# EAGLE schematic PCB-VU-SE-1 (EAGLE 6.4)
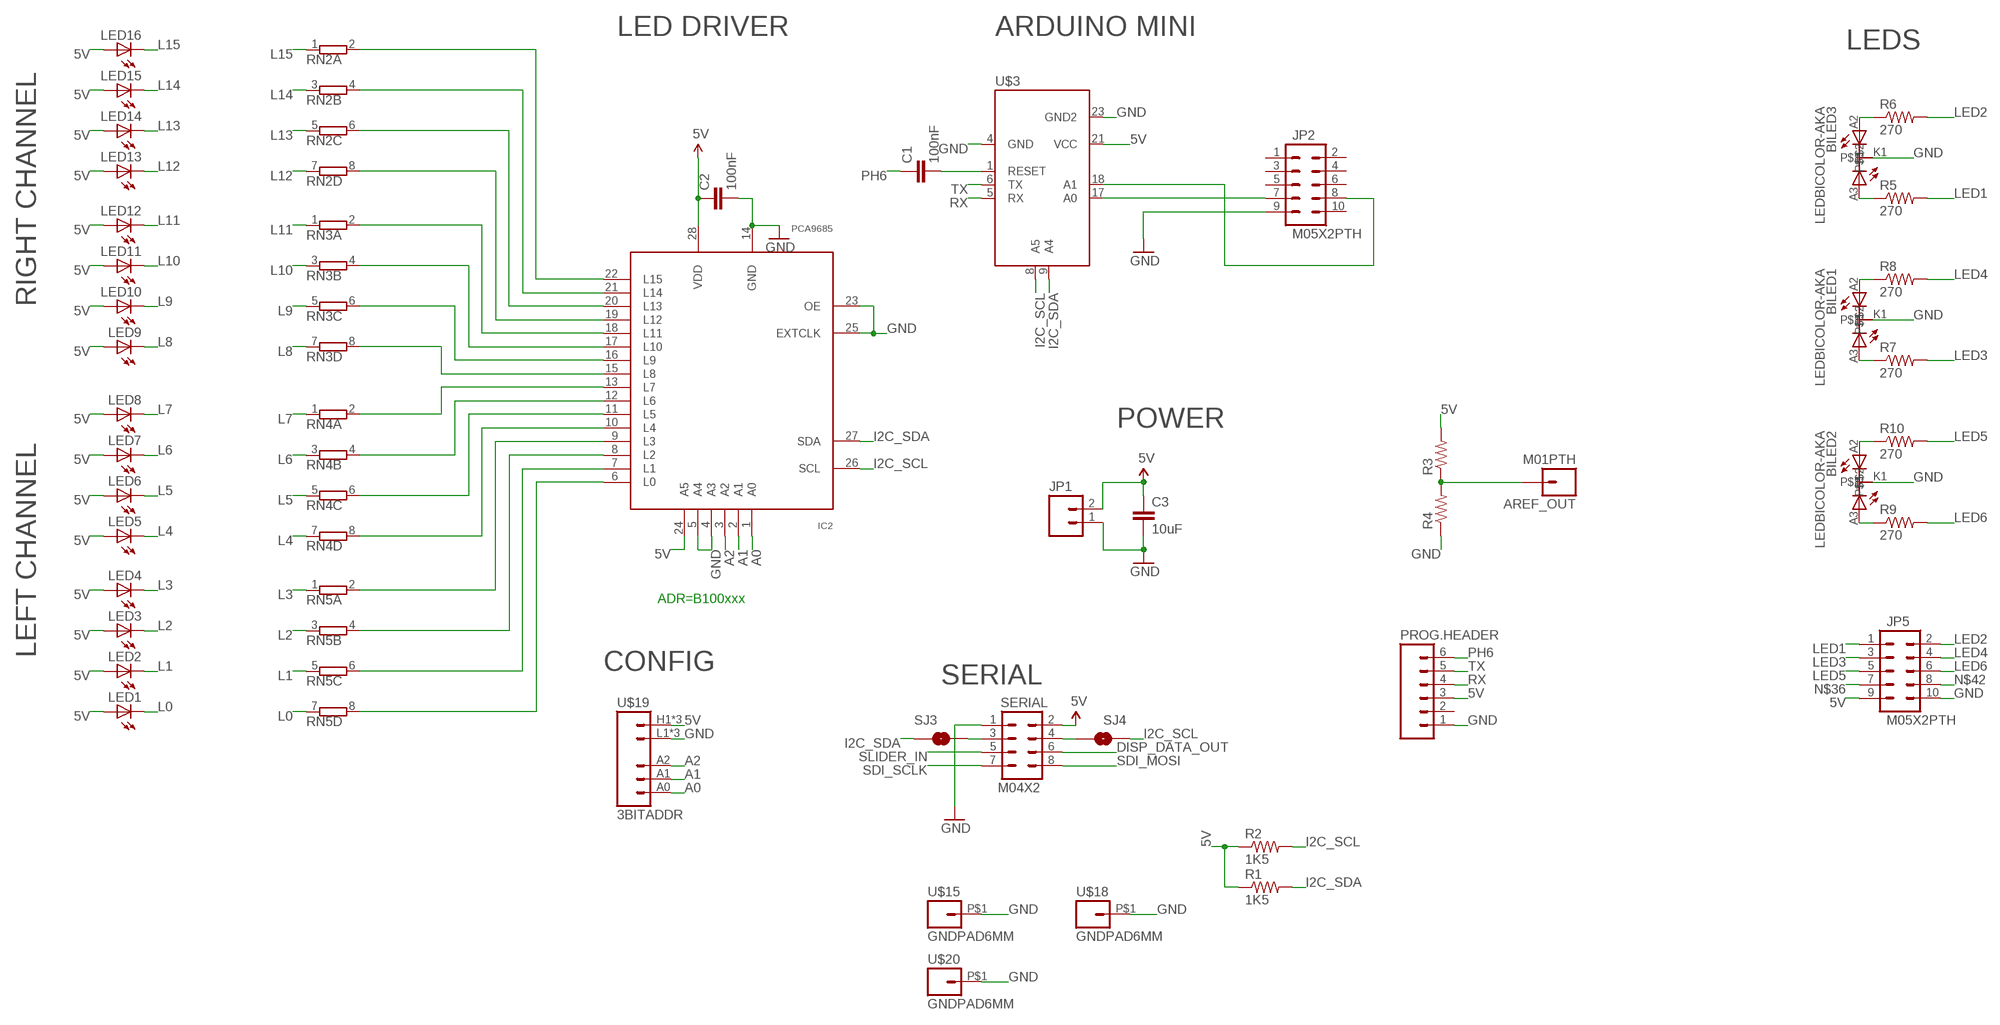
[diagram p0: schematic, sheet 1]

## Parts
AREF_OUT  M01PTH  [1X01]
BILED1  LEDBICOLOR-AKA  [LED5MM-BICOLOR]
BILED2  LEDBICOLOR-AKA  [LED5MM-BICOLOR]
BILED3  LEDBICOLOR-AKA  [LED5MM-BICOLOR]
C1  100nF  CAP0603-CAP  [0603-CAP]
C2  100nF  CAP0603-CAP  [0603-CAP]
C3  10uF  CAP0805  [0805]
IC2  PCA9685  [TSSOP28]
JP1  M02PTH  [1X02]
JP2  M05X2PTH  [AVR_ICSP]
JP5  M05X2PTH  [AVR_ICSP]
LED1  LED3MM  [LED3MM]
LED2  LED3MM  [LED3MM]
LED3  LED3MM  [LED3MM]
LED4  LED3MM  [LED3MM]
LED5  LED3MM  [LED3MM]
LED6  LED3MM  [LED3MM]
LED7  LED3MM  [LED3MM]
LED8  LED3MM  [LED3MM]
LED9  LED3MM  [LED3MM]
LED10  LED3MM  [LED3MM]
LED11  LED3MM  [LED3MM]
LED12  LED3MM  [LED3MM]
LED13  LED3MM  [LED3MM]
LED14  LED3MM  [LED3MM]
LED15  LED3MM  [LED3MM]
LED16  LED3MM  [LED3MM]
PROG.HEADER  M06LOCK  [1X06_LOCK]
R1  1K5  RESISTOR0603-RES  [0603-RES]
R2  1K5  RESISTOR0603-RES  [0603-RES]
R3  RESISTOR0603-RES  [0603-RES]
R4  RESISTOR0603-RES  [0603-RES]
R5  270  RESISTOR0603-RES  [0603-RES]
R6  270  RESISTOR0603-RES  [0603-RES]
R7  270  RESISTOR0603-RES  [0603-RES]
R8  270  RESISTOR0603-RES  [0603-RES]
R9  270  RESISTOR0603-RES  [0603-RES]
R10  270  RESISTOR0603-RES  [0603-RES]
RN2  E4R  [SIL8]
RN3  E4R  [SIL8]
RN4  E4R  [SIL8]
RN5  E4R  [SIL8]
SERIAL  M04X2  [2X4]
SJ3  SOLDERJUMPERNC  [SJ_2S]
SJ4  SOLDERJUMPERNC  [SJ_2S]
U$3  ARDUINO_MINI_SE1  [ARDUINO_MINI_SE1]
U$15  GNDPAD6MM  [3.2MMPAD6MM]
U$18  GNDPAD6MM  [3.2MMPAD6MM]
U$19  3BITADDR  [3BITADDR]
U$20  GNDPAD6MM  [3.2MMPAD6MM]

## Nets
5V [Power]: C2.1 C3.1 IC2.24(A5) IC2.28(VDD) JP1.2 JP5.9 LED1.A LED2.A LED3.A LED4.A LED5.A LED6.A LED7.A LED8.A LED9.A LED10.A LED11.A LED12.A LED13.A LED14.A LED15.A LED16.A PROG.HEADER.3 R1.1 R2.1 R3.2 SERIAL.2 U$3.21(VCC) U$19.H1(VCC) U$19.H2(VCC) U$19.H3(VCC)
A0: IC2.1(A0) U$19.A0
A1: IC2.2(A1) U$19.A1
A2: IC2.3(A2) U$19.A2
AREF: AREF_OUT.1 R3.1 R4.2
DISP_DATA_OUT: SERIAL.6
GND [Power]: BILED1.K1 BILED2.K1 BILED3.K1 C2.2 C3.2 IC2.4(A3) IC2.5(A4) IC2.14(GND) IC2.23(OE) IC2.25(EXTCLK) JP1.1 JP2.9 JP5.10 PROG.HEADER.1 R4.1 SERIAL.1 U$3.4(GND) U$3.23(GND2) U$15.P$1 U$18.P$1 U$19.L1(GND) U$19.L2(GND) U$19.L3(GND) U$20.P$1
I2C_SCL: IC2.26(SCL) R2.2 SJ4.2 U$3.8(A5)
I2C_SDA: IC2.27(SDA) R1.2 SJ3.1 U$3.9(A4)
L0: LED1.K(C) RN5.7
L1: LED2.K(C) RN5.5
L2: LED3.K(C) RN5.3
L3: LED4.K(C) RN5.1
L4: LED5.K(C) RN4.7
L5: LED6.K(C) RN4.5
L6: LED7.K(C) RN4.3
L7: LED8.K(C) RN4.1
L8: LED9.K(C) RN3.7
L9: LED10.K(C) RN3.5
L10: LED11.K(C) RN3.3
L11: LED12.K(C) RN3.1
L12: LED13.K(C) RN2.7
L13: LED14.K(C) RN2.5
L14: LED15.K(C) RN2.3
L15: LED16.K(C) RN2.1
LED1: JP5.1 R5.2
LED2: JP5.2 R6.2
LED3: JP5.3 R7.2
LED4: JP5.4 R8.2
LED5: JP5.5 R10.2
LED6: JP5.6 R9.2
N$3: SERIAL.3 SJ3.2
N$4: IC2.13(L7) RN4.2
N$5: IC2.12(L6) RN4.4
N$6: SERIAL.4 SJ4.1
N$7: IC2.11(L5) RN4.6
N$9: IC2.10(L4) RN4.8
N$10: IC2.9(L3) RN5.2
N$11: IC2.8(L2) RN5.4
N$12: IC2.7(L1) RN5.6
N$16: JP2.8 U$3.18(A1)
N$17: JP2.7 U$3.17(A0)
N$18: BILED3.A2 R6.1
N$19: IC2.6(L0) RN5.8
N$20: IC2.15(L8) RN3.8
N$21: IC2.16(L9) RN3.6
N$22: IC2.17(L10) RN3.4
N$23: IC2.18(L11) RN3.2
N$24: IC2.19(L12) RN2.8
N$25: IC2.20(L13) RN2.6
N$26: IC2.21(L14) RN2.4
N$27: IC2.22(L15) RN2.2
N$28: BILED3.A3 R5.1
N$29: BILED1.A2 R8.1
N$30: BILED1.A3 R7.1
N$31: BILED2.A2 R10.1
N$32: BILED2.A3 R9.1
N$36: JP5.7
N$37: C1.2 U$3.1(RESET)
N$42: JP5.8
PH6: C1.1 PROG.HEADER.6
RX: PROG.HEADER.4 U$3.5(RX)
SDI_MOSI: SERIAL.8
SDI_SCLK: SERIAL.7
SLIDER_IN: SERIAL.5
TX: PROG.HEADER.5 U$3.6(TX)
Unconnected: JP2.1 JP2.2 JP2.3 JP2.4 JP2.5 JP2.6 JP2.10 PROG.HEADER.2

## Notes on the sheet
- LED DRIVER | ARDUINO MINI
- LEDS
- RIGHT CHANNEL
- POWER
- ADR=B100xxx
- LEFT CHANNEL
- CONFIG
- SERIAL

## Library data of the parts
AREF_OUT = SparkFun:M01: Header 1 Standard 1-pin 0.1" header. Use with straight break away headers (SKU : PRT-00116), right angle break away headers (PRT-00553), swiss pins (PRT-00743), machine pins (PRT-00117), and female headers (PRT-00115).
BILED1-BILED3 = SKAARHOJ:LEDBICOLOR-AKA
C1-C3 = SparkFun:CAP: Capacitor Standard 0603 ceramic capacitor, and 0.1" leaded capacitor.
IC2 = wsmith:PCA9685
JP1 = SparkFun:M02: Header 2 Standard 2-pin 0.1" header. Use with straight break away headers (SKU : PRT-00116), right angle break away headers (PRT-00553), swiss pins (PRT-00743), machine pins (PRT-00117), and female headers (PRT-00115). Molex polarized connector foot print use with SKU : PRT-08233 with associated crimp pins and housings.
JP2 JP5 = SparkFun:M05X2: Header 5x2 Standard 10-pin dual row 0.1" header. Commonly used with AVR-ISP. Use with Spark Fun Electronics SKU: PRT-00778
LED1-LED16 = SparkFun:LED: LEDs Standard schematic elements and footprints for 5mm, 3mm, 1206, and 0603 sized LEDs. 5mm - Spark Fun Electronics SKU : COM-00529 (and others)
PROG.HEADER = SparkFun:M06: Header 6 Standard 6-pin 0.1" header. Use with straight break away headers (SKU : PRT-00116), right angle break away headers (PRT-00553), swiss pins (PRT-00743), machine pins (PRT-00117), and female headers (PRT-00115). Molex polarized connector foot print use with SKU : PRT-08094 with associated crimp pins and housings. NOTES ON THE VARIANTS LOCK and LOCK_LONGPADS... This footprint was designed to help hold the alignment of a through-hole component (i.e. 6-pin header) while soldering it into place. You may notice that each hole has been shifted either up or down by 0.005 of an inch from it's more standard position (which is a perfectly straight line). This slight alteration caused the pins (the squares in the middle) to touch the edges of the holes. Because they are alternating, it causes a "brace" to hold the component in place. 0.005 has proven to be the perfect amount of "off-center" position when using our standard breakaway headers. Although looks a little odd when you look at the bare footprint, once you have a header in there, the alteration is very hard to notice. Also, if you push a header all the way into place, it is covered up entirely on the bottom side. This idea of altering the position of holes to aid alignment will be further integrated into the Sparkfun Library for other footprints. It can help hold any component with 3 or more connection pins.
R1-R10 = SparkFun:RESISTOR: Resistor Basic schematic elements and footprints for 0603, 1206, and PTH resistors.
RN2-RN5 = SKAARHOJ:E4R: SIL RESISTOR; OC_FARNELL: unknown; OC_NEWARK: unknown
SERIAL = SparkFun:M04X2
SJ3 SJ4 = SparkFun:SOLDERJUMPER: Solder Jumper Standard SMD solder jumper. Used to automate production. Two varients : Normally Open and Normally Closed are the same, but have different paste layers. NC will have a large amount of paste and should jumper during reflow.
U$3 = SKAARHOJ:ARDUINO_MINI_SE1
U$15 U$18 U$20 = SKAARHOJ:GNDPAD
U$19 = SKAARHOJ:3BITADDR

## Net classes
0 default: width 0.203 mm, drill 0.305 mm, clearance 0.203 mm
1 Power: width 0.406 mm, drill 0.61 mm, clearance 0.203 mm